# EAGLE schematic TestBench_rev2 (EAGLE 6.3)
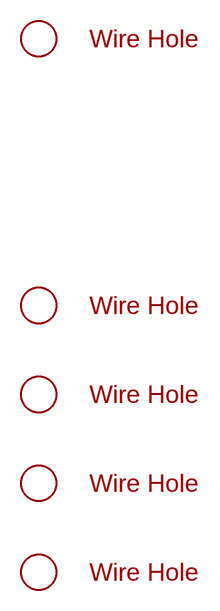
[diagram p0: schematic, sheet 1, part 1 of 2]
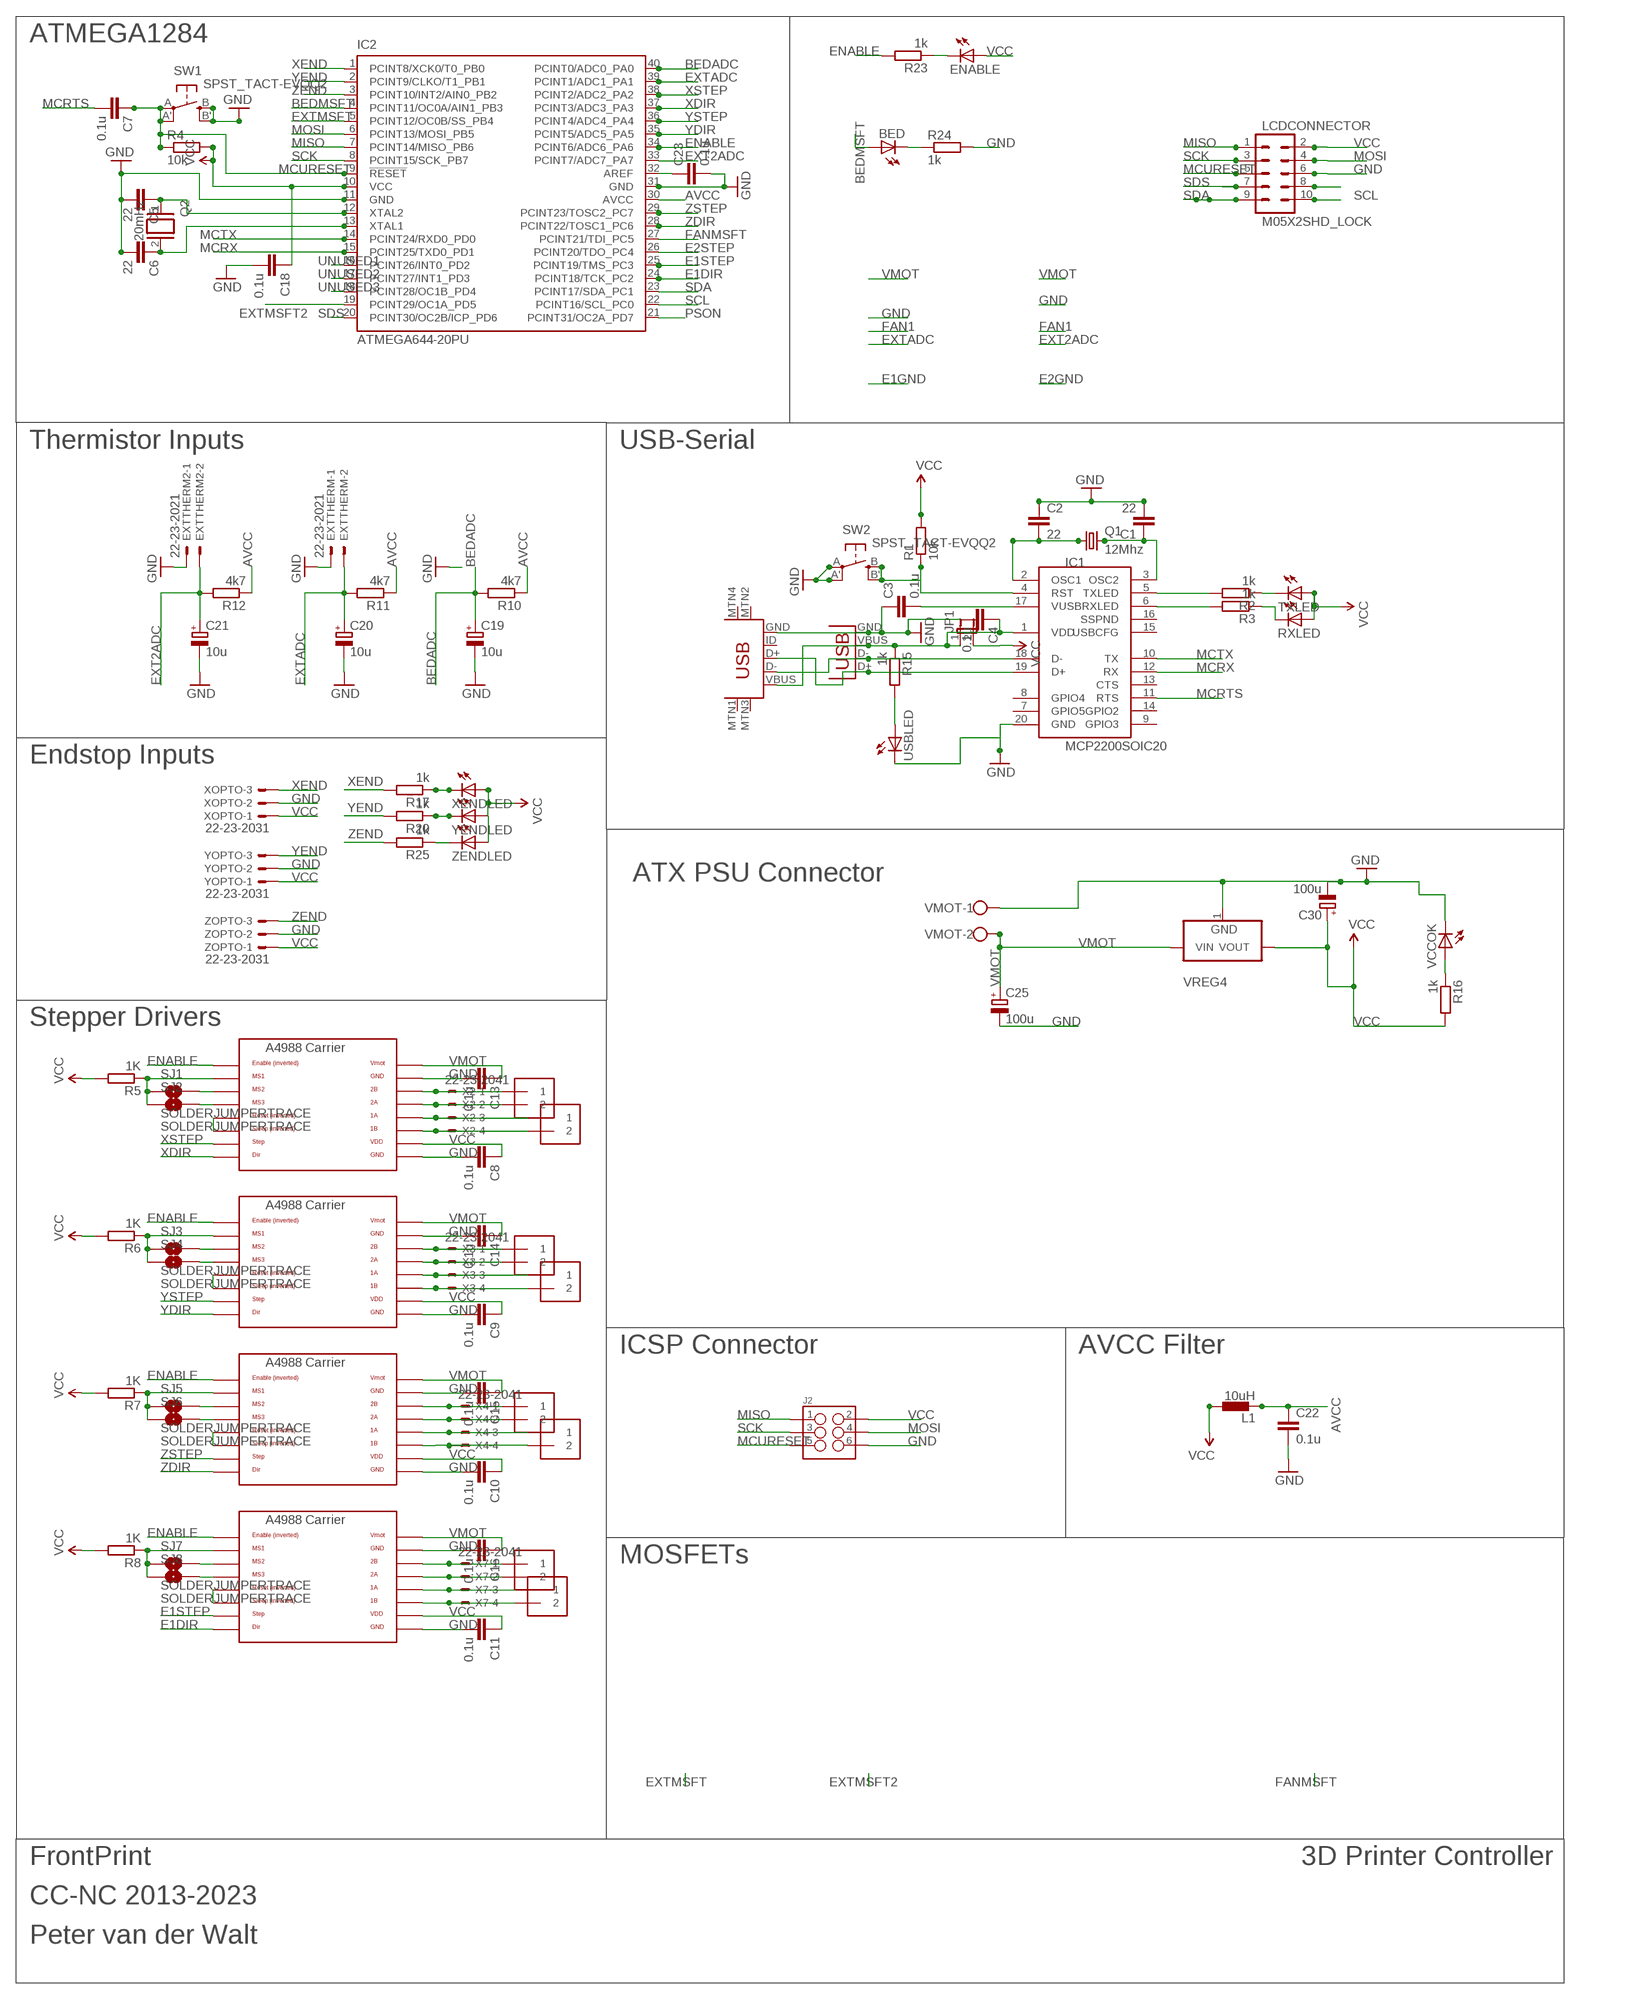
[diagram p1: schematic, sheet 1, part 2 of 2]

## Parts
BED  LEDSMT1206  [1206]
C1  22  CAP1206  [1206]
C2  22  CAP1206  [1206]
C3  0.1u  CAP1206  [1206]
C4  0.1u  CAP1206  [1206]
C5  22  CAP1206  [1206]
C6  22  CAP1206  [1206]
C7  0.1u  CAP1206  [1206]
C8  0.1u  CAP1206  [1206]
C9  0.1u  CAP1206  [1206]
C10  0.1u  CAP1206  [1206]
C11  0.1u  CAP1206  [1206]
C13  0.1u  CAP1206  [1206]
C14  0.1u  CAP1206  [1206]
C15  0.1u  CAP1206  [1206]
C16  0.1u  CAP1206  [1206]
C18  0.1u  CAP1206  [1206]
C19  10u  CPOL-EUE2.5-5  [E2,5-5]
C20  10u  CPOL-EUE2.5-5  [E2,5-5]
C21  10u  CPOL-EUE2.5-5  [E2,5-5]
C22  0.1u  CAP1206  [1206]
C23  0.1u  CAP1206  [1206]
C25  100u  CPOL-EUE5-8.5  [E5-8,5]
C30  100u  CPOL-EUE5-8.5  [E5-8,5]
E1MOT1  1X2-3.5MM  [3.5MMTERM]
E1MOT2  1X2-3.5MM  [3.5MMTERM]
ENABLE  LEDSMT1206  [1206]
EPOLOLU  POLOLU_A4983CARRIER  [A4988BREAKOUT]
EXTTHERM  22-23-2021  [22-23-2021]
EXTTHERM2  22-23-2021  [22-23-2021]
IC1  MCP2200SOIC20  [SOIC20]
IC2  ATMEGA644-20PU  [DIL40]
J2  M03X2  [2X3-SHROUDED]
JP1  JUMPER-2PTH_LOCK  [1X02_LOCK]
L1  10uH  BL01RN1A  [BL01RN1A]
LCDCONNECTOR  M05X2SHD_LOCK  [2X5-SHROUDED_LOCK]
Q1  12Mhz  CRYSTALHC49UP  [HC49UP]
Q2  20mHz  XTAL/S  [QS]
R1  10k  R-EU_M1206  [M1206]
R2  1k  R-EU_M1206  [M1206]
R3  1k  R-EU_M1206  [M1206]
R4  10k  R-EU_M1206  [M1206]
R5  1K  R-EU_M1206  [M1206]
R6  1K  R-EU_M1206  [M1206]
R7  1K  R-EU_M1206  [M1206]
R8  1K  R-EU_M1206  [M1206]
R10  4k7  R-EU_M1206  [M1206]
R11  4k7  R-EU_M1206  [M1206]
R12  4k7  R-EU_M1206  [M1206]
R15  1k  R-EU_M1206  [M1206]
R16  1k  R-EU_M1206  [M1206]
R17  1k  R-EU_M1206  [M1206]
R20  1k  R-EU_M1206  [M1206]
R23  1k  R-EU_M1206  [M1206]
R24  1k  R-EU_M1206  [M1206]
R25  1k  R-EU_M1206  [M1206]
RXLED  LEDSMT1206  [1206]
SJ1  SOLDERJUMPERTRACE  [SJ_2S-TRACE]
SJ2  SOLDERJUMPERTRACE  [SJ_2S-TRACE]
SJ3  SOLDERJUMPERTRACE  [SJ_2S-TRACE]
SJ4  SOLDERJUMPERTRACE  [SJ_2S-TRACE]
SJ5  SOLDERJUMPERTRACE  [SJ_2S-TRACE]
SJ6  SOLDERJUMPERTRACE  [SJ_2S-TRACE]
SJ7  SOLDERJUMPERTRACE  [SJ_2S-TRACE]
SJ8  SOLDERJUMPERTRACE  [SJ_2S-TRACE]
SW1  SPST_TACT-EVQQ2  [EVQ-Q2]
SW2  SPST_TACT-EVQQ2  [EVQ-Q2]
TXLED  LEDSMT1206  [1206]
U$1  3MMHOLE  [3MMHOLE]
U$2  USB-MINIB-5PIN  [USB-MINIB]
U$5  3MMHOLE  [3MMHOLE]
U$6  3MMHOLE  [3MMHOLE]
U$7  3MMHOLE  [3MMHOLE]
U$8  3MMHOLE  [3MMHOLE]
USBLED  LEDSMT1206  [1206]
VCCOK  LEDSMT1206  [1206]
VMOT  W237-102  [W237-102]
VREG4  VREG_3PINS-DPAK  [DPAK]
X1  USBPTH  [USB-B-PTH]
X2  22-23-2041  [22-23-2041]
X3  22-23-2041  [22-23-2041]
X4  22-23-2041  [22-23-2041]
X7  22-23-2041  [22-23-2041]
XENDLED  LEDSMT1206  [1206]
XMOT1  1X2-3.5MM  [3.5MMTERM]
XMOT2  1X2-3.5MM  [3.5MMTERM]
XOPTO  22-23-2031  [22-23-2031]
XPOLOLU  POLOLU_A4983CARRIER  [A4988BREAKOUT]
YENDLED  LEDSMT1206  [1206]
YMOT1  1X2-3.5MM  [3.5MMTERM]
YMOT2  1X2-3.5MM  [3.5MMTERM]
YOPTO  22-23-2031  [22-23-2031]
YPOLOLU  POLOLU_A4983CARRIER  [A4988BREAKOUT]
ZENDLED  LEDSMT1206  [1206]
ZMOT1  1X2-3.5MM  [3.5MMTERM]
ZMOT2  1X2-3.5MM  [3.5MMTERM]
ZOPTO  22-23-2031  [22-23-2031]
ZPOLOLU  POLOLU_A4983CARRIER  [A4988BREAKOUT]

## Nets
AVCC: C22.1 IC2.30(AVCC) L1.1 R10.1 R11.1 R12.1
BEDADC: C19.+ IC2.40(PCINT0/ADC0_PA0) R10.2
BEDMSFT: BED.A IC2.4(PCINT11/OC0A/AIN1_PB3)
E1DIR: EPOLOLU.DIR IC2.24(PCINT18/TCK_PC2)
E1STEP: EPOLOLU.STEP IC2.25(PCINT19/TMS_PC3)
E2STEP: IC2.26(PCINT20/TDO_PC4)
E11A: E1MOT2.1 EPOLOLU.1A X7.3
E11B: E1MOT2.2 EPOLOLU.1B X7.4
E12A: E1MOT1.2 EPOLOLU.2A X7.2
E12B: E1MOT1.1 EPOLOLU.2B X7.1
ENABLE: EPOLOLU.EN IC2.34(PCINT6/ADC6_PA6) R23.2 XPOLOLU.EN YPOLOLU.EN ZPOLOLU.EN
EXT2ADC: C21.+ EXTTHERM2.2 IC2.33(PCINT7/ADC7_PA7) R12.2
EXTADC: C20.+ EXTTHERM.2 IC2.39(PCINT1/ADC1_PA1) R11.2
EXTMSFT: IC2.5(PCINT12/OC0B/SS_PB4)
EXTMSFT2: IC2.19(PCINT29/OC1A_PD5)
FANMSFT: IC2.27(PCINT21/TDI_PC5)
GND: C1.2 C2.1 C3.1 C4.2 C5.2 C6.2 C8.2 C9.2 C10.2 C11.2 C13.2 C14.2 C15.2 C16.2 C18.2 C19.- C20.- C21.- C22.2 C23.2 C25.- C30.- EPOLOLU.GND EPOLOLU.GND@0(GND) EXTTHERM2.1 EXTTHERM.1 IC1.20(GND) IC2.11(GND) IC2.31(GND) J2.6 LCDCONNECTOR.6 R24.2 SW1.B'(S1) SW1.B(S) SW2.A'(P1) SW2.A(P) U$2.GND USBLED.C VCCOK.C VMOT.1 VREG4.1(GND) X1.GND XOPTO.2 XPOLOLU.GND XPOLOLU.GND@0(GND) YOPTO.2 YPOLOLU.GND YPOLOLU.GND@0(GND) ZOPTO.2 ZPOLOLU.GND ZPOLOLU.GND@0(GND)
MCRTS: C7.2 IC1.11(RTS)
MCRX: IC1.12(RX) IC2.15(PCINT25/TXD0_PD1)
MCTX: IC1.10(TX) IC2.14(PCINT24/RXD0_PD0)
MCURESET: C7.1 IC2.9(!RESET) J2.5 LCDCONNECTOR.5 R4.1 SW1.A'(P1) SW1.A(P)
MISO: IC2.7(PCINT14/MISO_PB6) J2.1 LCDCONNECTOR.1
MOSI: IC2.6(PCINT13/MOSI_PB5) J2.4 LCDCONNECTOR.4
N$1: C2.2 IC1.2(OSC1) Q1.1
N$2: C1.1 IC1.3(OSC2) Q1.2
N$3: IC1.5(TXLED) R2.2
N$4: IC1.18(D-) U$2.D- X1.D-
N$5: IC1.19(D+) U$2.D+ X1.D+
N$6: IC1.6(RXLED) R3.2
N$7: C3.2 IC1.17(VUSB)
N$9: R2.1 TXLED.C
N$10: R3.1 RXLED.C
N$11: C5.1 IC2.12(XTAL2) Q2.1
N$12: C6.1 IC2.13(XTAL1) Q2.2
N$13: IC1.4(RST) R1.1 SW2.B'(S1) SW2.B(S)
N$14: R7.1 SJ5.1 SJ6.1 ZPOLOLU.MS1
N$15: SJ6.2 ZPOLOLU.MS3
N$16: SJ5.2 ZPOLOLU.MS2
N$17: EPOLOLU.MS2 SJ7.2
N$18: EPOLOLU.MS3 SJ8.2
N$19: EPOLOLU.MS1 R8.1 SJ7.1 SJ8.1
N$20: SJ3.2 YPOLOLU.MS2
N$21: SJ4.2 YPOLOLU.MS3
N$22: R6.1 SJ3.1 SJ4.1 YPOLOLU.MS1
N$23: SJ1.2 XPOLOLU.MS2
N$24: SJ2.2 XPOLOLU.MS3
N$25: R5.1 SJ1.1 SJ2.1 XPOLOLU.MS1
N$26: XPOLOLU.RST XPOLOLU.SLP(SLEEP)
N$27: YPOLOLU.RST YPOLOLU.SLP(SLEEP)
N$28: ZPOLOLU.RST ZPOLOLU.SLP(SLEEP)
N$29: EPOLOLU.RST EPOLOLU.SLP(SLEEP)
N$34: X4.4 ZMOT2.2 ZPOLOLU.1B
N$35: X4.3 ZMOT2.1 ZPOLOLU.1A
N$36: X4.2 ZMOT1.2 ZPOLOLU.2A
N$37: X4.1 ZMOT1.1 ZPOLOLU.2B
N$38: X3.4 YMOT2.2 YPOLOLU.1B
N$39: X3.3 YMOT2.1 YPOLOLU.1A
N$40: X3.2 YMOT1.2 YPOLOLU.2A
N$41: X3.1 YMOT1.1 YPOLOLU.2B
N$42: X2.4 XMOT2.2 XPOLOLU.1B
N$43: X2.3 XMOT2.1 XPOLOLU.1A
N$44: X2.2 XMOT1.2 XPOLOLU.2A
N$45: X2.1 XMOT1.1 XPOLOLU.2B
N$54: C23.1 IC2.32(AREF)
N$57: R17.1 XENDLED.C
N$58: C4.1 IC1.1(VDD) JP1.1 R15.1 U$2.VBUS X1.VBUS
N$59: BED.C R24.1
N$60: R20.1 YENDLED.C
N$62: R25.1 ZENDLED.C
N$64: R16.1 VCCOK.A
N$68: R15.2 USBLED.A
N$71: ENABLE.C R23.1
N$73: LCDCONNECTOR.8
PSON: IC2.21(PCINT31/OC2A_PD7)
SCK: IC2.8(PCINT15/SCK_PB7) J2.3 LCDCONNECTOR.3
SCL: IC2.22(PCINT16/SCL_PC0) LCDCONNECTOR.10
SDA: IC2.23(PCINT17/SDA_PC1) LCDCONNECTOR.9
SDS: IC2.20(PCINT30/OC2B/ICP_PD6) LCDCONNECTOR.7
UNUSED1: IC2.16(PCINT26/INT0_PD2)
UNUSED2: IC2.17(PCINT27/INT1_PD3)
UNUSED3: IC2.18(PCINT28/OC1B_PD4)
VCC: C8.1 C9.1 C10.1 C11.1 C18.1 C30.+ ENABLE.A EPOLOLU.VDD IC2.10(VCC) J2.2 JP1.2 L1.2 LCDCONNECTOR.2 R1.2 R4.2 R5.2 R6.2 R7.2 R8.2 R16.2 RXLED.A TXLED.A VREG4.2(VOUT) XENDLED.A XOPTO.1 XPOLOLU.VDD YENDLED.A YOPTO.1 YPOLOLU.VDD ZENDLED.A ZOPTO.1 ZPOLOLU.VDD
VMOT: C13.1 C14.1 C15.1 C16.1 C25.+ EPOLOLU.VMOT VMOT.2 VREG4.3(VIN) XPOLOLU.VMOT YPOLOLU.VMOT ZPOLOLU.VMOT
XDIR: IC2.37(PCINT3/ADC3_PA3) XPOLOLU.DIR
XEND: IC2.1(PCINT8/XCK0/T0_PB0) R17.2 XOPTO.3
XSTEP: IC2.38(PCINT2/ADC2_PA2) XPOLOLU.STEP
YDIR: IC2.35(PCINT5/ADC5_PA5) YPOLOLU.DIR
YEND: IC2.2(PCINT9/CLKO/T1_PB1) R20.2 YOPTO.3
YSTEP: IC2.36(PCINT4/ADC4_PA4) YPOLOLU.STEP
ZDIR: IC2.28(PCINT22/TOSC1_PC6) ZPOLOLU.DIR
ZEND: IC2.3(PCINT10/INT2/AIN0_PB2) R25.2 ZOPTO.3
ZSTEP: IC2.29(PCINT23/TOSC2_PC7) ZPOLOLU.STEP
Unconnected: IC1.7(GPIO5) IC1.8(GPIO4) IC1.9(GPIO3) IC1.13(CTS) IC1.14(GPIO2) IC1.15(USBCFG) IC1.16(SSPND) U$2.ID U$2.MTN1(MTN2) U$2.MTN2(MTN3) U$2.MTN3(MTN1) U$2.MTN4

## Notes on the sheet
- ATMEGA1284
- Thermistor Inputs | USB-Serial
- Endstop Inputs
- ATX PSU Connector
- Stepper Drivers
- ICSP Connector | AVCC Filter
- MOSFETs
- FrontPrint | 3D Printer Controller
- CC-NC 2013-2023
- Peter van der Walt

## Library data of the parts
BED ENABLE RXLED TXLED USBLED VCCOK XENDLED YENDLED ZENDLED = led:LED: LED OSRAM: - CHIPLED LG R971, LG N971, LY N971, LG Q971, LY Q971, LO R971, LY R971 LH N974, LH R974 LS Q976, LO Q976, LY Q976 LO Q996 - Hyper CHIPLED LW Q18S LB Q993, LB Q99A, LB R99A - SideLED LS A670, LO A670, LY A670, LG A670, LP A670 LB A673, LV A673, LT A673, LW A673 LH A674 LY A675 LS A676, LA A676, LO A676, LY A676, LW A676 LS A679, LY A679, LG A679 - Hyper Micro SIDELED® LS Y876, LA Y876, LO Y876, LY Y876 LT Y87S - SmartLED LW L88C, LW L88S LB L89C, LB L89S, LG L890 LS L89K, LO L89K, LY L89K LS L896, LA L896, LO L896, LY L896 - TOPLED LS T670, LO T670, LY T670, LG T670, LP T670 LSG T670, LSP T670, LSY T670, LOP T670, LYG T670 LG T671, LOG T671, LSG T671 LB T673, LV T673, LT T673, LW T673 LH T674 LS T676, LA T676, LO T676, LY T676, LB T676, LH T676, LSB T676, LW T676 LB T67C, LV T67C, LT T67C, LS T67K, LO T67K, LY T67K, LW E67C LS E67B, LA E67B, LO E67B, LY E67B, LB E67C, LV E67C, LT E67C LW T67C LS T679, LY T679, LG T679 LS T770, LO T770, LY T770, LG T770, LP T770 LB T773, LV T773, LT T773, LW T773 LH T774 LS E675, LA E675, LY E675, LS T675 LS T776, LA T776, LO T776, LY T776, LB T776 LHGB T686 LT T68C, LB T68C - Hyper Mini TOPLED® LB M676 - Mini TOPLED Santana® LG M470 LS M47K, LO M47K, LY M47K Source: http://www.osram.convergy.de LUXEON: - LUMILED® LXK2-PW12-R00, LXK2-PW12-S00, LXK2-PW14-U00, LXK2-PW14-V00 LXK2-PM12-R00, LXK2-PM12-S00, LXK2-PM14-U00 LXK2-PE12-Q00, LXK2-PE12-R00, LXK2-PE12-S00, LXK2-PE14-T00, LXK2-PE14-U00 LXK2-PB12-K00, LXK2-PB12-L00, LXK2-PB12-M00, LXK2-PB14-N00, LXK2-PB14-P00, LXK2-PB14-Q00 LXK2-PR12-L00, LXK2-PR12-M00, LXK2-PR14-Q00, LXK2-PR14-R00 LXK2-PD12-Q00, LXK2-PD12-R00, LXK2-PD12-S00 LXK2-PH12-R00, LXK2-PH12-S00 LXK2-PL12-P00, LXK2-PL12-Q00, LXK2-PL12-R00 Source: www.luxeon.com KINGBRIGHT: KA-3528ASYC Source: www.kingbright.com
C1-C11 C13-C16 C18 C22 C23 = SparkFun-Passives:CAP: Capacitor Standard 0603 ceramic capacitor, and 0.1" leaded capacitor.
C19-C21 C25 C30 = rcl:CPOL-EU: POLARIZED CAPACITOR, European symbol
E1MOT1 E1MOT2 XMOT1 XMOT2 YMOT1 YMOT2 ZMOT1 ZMOT2 = adafruit:1X2: 3.5mm Terminal block http://www.ladyada.net/library/pcb/eaglelibrary.html
EPOLOLU XPOLOLU YPOLOLU ZPOLOLU = RepRapjr:POLOLU_A4983CARRIER
EXTTHERM EXTTHERM2 = con-molex:22-23-2021: .100" (2.54mm) Center Header - 2 Pin; MF: MOLEX; MPN: 22-23-2021; OC_FARNELL: 1462926; OC_NEWARK: 25C3832
IC1 = microchip-update-2:MCP2200: USB 2.0 to UART Protocol Converter with GPIO
IC2 = atmel:ATMEGA644-*PU: 8-bit Microcontroller with 64K Bytes In-System Programmable Flash Auto generated by make-symbol-device-package-bsdl.ulp Rev. 34 Source: http://www.atmel.com/dyn/resources/prod_documents/doc2593.pdf; MPN: ATMEGA644-20PU; OC_FARNELL: 1288340; OC_NEWARK: 23M5060
J2 = SparkFun-Connectors:M03X2: 2x3 .1" header. Shrouded, with keying- CONN-10681 SMT- CONN-11415 Pogo pins- HW-11044; PROD_ID: CONN-10681
JP1 = SparkFun-Passives:JUMPER-2: Jumper Basic 0.1" spaced jumper. Use with breakaway headers.
L1 = inductors:BL0: Noise Suppression Products/EMI Suppression Filters, Lead EMIFIL(R) Inductor Type Source: http://www.murata.com .. BL01RN1_DS.pdf
LCDCONNECTOR = SparkFun-Connectors:M05X2: Header 5x2 Standard 10-pin dual row 0.1" header. Commonly used with AVR-ISP. Use with Spark Fun Electronics SKU: PRT-00778
Q1 = adafruit:CRYSTAL: CRYSTAL; OC_FARNELL: unknown; OC_NEWARK: unknown
Q2 = special:XTAL/S: CRYSTAL
R1-R8 R10-R12 R15-R17 R20 R23-R25 = resistor:R-EU_: RESISTOR, European symbol
SJ1-SJ8 = SparkFun-Passives:SOLDERJUMPER: Solder Jumper Standard SMD solder jumper. Used to automate production. Two varients : Normally Open and Normally Closed are the same, but have different paste layers. NC will have a large amount of paste and should jumper during reflow.
SW1 SW2 = adafruit:SPST_TACT: SMT 6mm switch, EVQQ2 series http://www.ladyada.net/library/eagle
U$1 U$5-U$8 = reprap:3MMHOLE
U$2 = SparkFun-Connectors:USB-MINIB: Mini-USB "B" connector with 5th pin broken out. Created new symbol breaking out 5th "ID" pin in mini/micro USB connector spec. See: http://en.wikipedia.org/wiki/Mini_usb#Cables. Uses same footprint as 4-pin symbol. Also added pins to connect to mounting / shield pads if required (probably not generally needed as signals aren't shielded once they leave the connector).
VMOT = con-wago-500:W237-102: WAGO SCREW CLAMP; MPN: 237-102; OC_FARNELL: unknown; OC_NEWARK: 70K9898
VREG4 = dp_devices:VREG_3PINS: Various 3 pin voltage regulators in different packages Double check the right pinout for the right part
X1 = SparkFun-Connectors:USB: USB Connectors USB-B-PTH is fully proven SKU : PRT-00139/CONN-08278 USB-miniB is fully proven SKU : PRT-00587 USB-A-PCB is untested. USB-A-H is throughly reviewed, but untested. Spark Fun Electronics SKU : PRT-00437 USB-B-SMT is throughly reviewed, but untested. Needs silkscreen touching up. USB-A-S has not been used/tested USB-MB-H has not been used/tested USB-MICROB has been used. CONN-09505; PROD_ID: CONN-08278; VALUE: USB-B
X2-X4 X7 = con-molex:22-23-2041: .100" (2.54mm) Center Header - 4 Pin; MF: MOLEX; MPN: 22-23-2041; OC_FARNELL: 1462920; OC_NEWARK: 38C0355
XOPTO YOPTO ZOPTO = con-molex:22-23-2031: .100" (2.54mm) Center Header - 3 Pin; MF: MOLEX; MPN: 22-23-2031; OC_FARNELL: 1462950; OC_NEWARK: 30C0862